# Altium schematic sheet IO Peripherals.SchDoc
size A4; DocumentNumber: 6; Revision: C.01; SheetNumber: 6; SheetTotal: 7
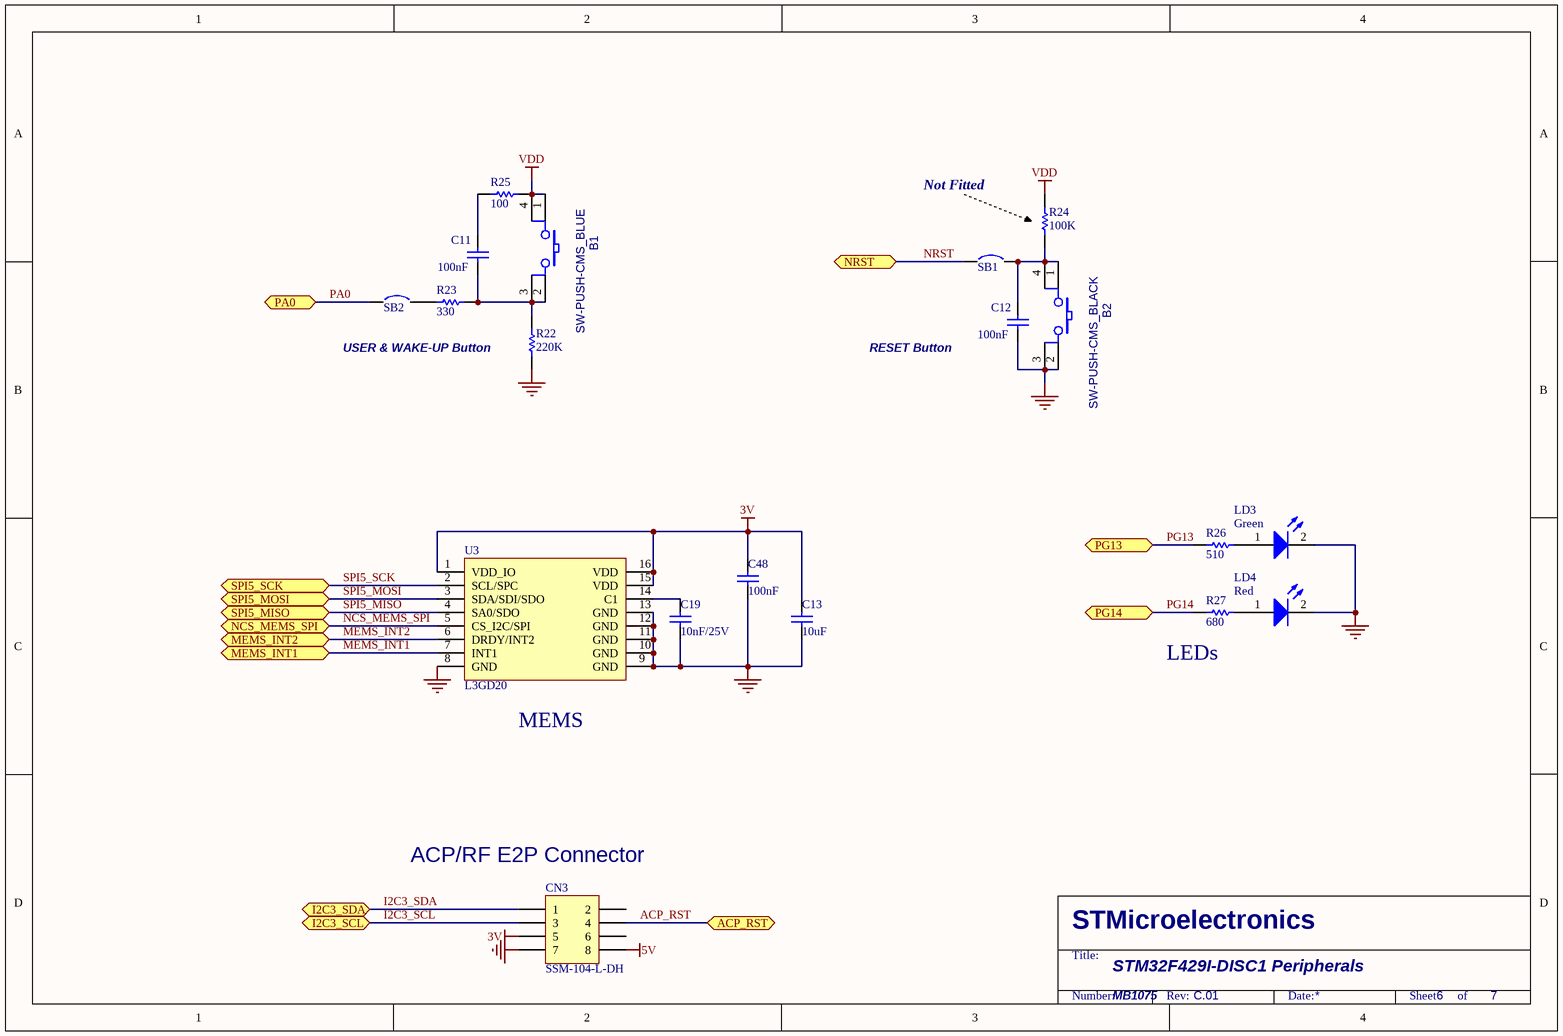
[diagram p0: IO Peripherals.SchDoc]

## Parts
B1  SW-PUSH-CMS_BLUE  [BP1CMS]
B2  SW-PUSH-CMS_BLACK  [BP1CMS]
C11  100nF  [0402C]
C12  100nF  [0402C]
C13  10uF  [0603C]
C19  10nF/25V  [0603C]
C48  100nF  [0402C]
CN3  SSM-104-L-DH  [SSM-104-L-DH]
LD3  Green  [0603D]
LD4  Red  [0603D]
R22  220K  [0402R]
R23  330  [0402R]
R24  100K  [0402R]
R25  100  [0402R]
R26  510  [0603R]
R27  680  [0603R]
SB1  Circuit Breaker  [JP2_SMD]  (value not drawn)
SB2  Circuit Breaker  [JP2_SMD]  (value not drawn)
U3  L3GD20  [LGA16-4x4]

## Ports
ACP_RST, I2C3_SCL, I2C3_SDA, MEMS_INT1, MEMS_INT2, NCS_MEMS_SPI, NRST, PA0, PG13, PG14, SPI5_MISO, SPI5_MOSI, SPI5_SCK

## Nets
3V: C13.2 C48.2 CN3.5 U3.1(VDD_IO) U3.15(VDD) U3.16(VDD)
5V: CN3.8
GND: B2.2 B2.3 C12.1 C13.1 C19.1 C48.1 CN3.7 LD3.2(K) LD4.2(K) R22.1 U3.8(GND) U3.9(GND) U3.10(GND) U3.11(GND) U3.12(GND) U3.13(GND)
VDD: B1.1 B1.4 R24.2 R25.2
ACP_RST: CN3.4 ; port ACP_RST
I2C3_SCL: CN3.3 ; port I2C3_SCL
I2C3_SDA: CN3.1 ; port I2C3_SDA
MEMS_INT1: U3.7(INT1) ; port MEMS_INT1
MEMS_INT2: U3.6(DRDY/INT2) ; port MEMS_INT2
NCS_MEMS_SPI: U3.5(CS_I2C/SPI) ; port NCS_MEMS_SPI
NRST: SB1.1 ; port NRST
PA0: SB2.1 ; port PA0
PG13: R26.1 ; port PG13
PG14: R27.1 ; port PG14
SPI5_MISO: U3.4(SA0/SDO) ; port SPI5_MISO
SPI5_MOSI: U3.3(SDA/SDI/SDO) ; port SPI5_MOSI
SPI5_SCK: U3.2(SCL/SPC) ; port SPI5_SCK
NetB1_2: B1.2 B1.3 C11.1 R22.2 R23.2
NetB2_1: B2.1 B2.4 C12.2 R24.1 SB1.2
NetC11_2: C11.2 R25.1
NetC19_2: C19.2 U3.14(C1)
NetLD3_1: LD3.1(A) R26.2
NetLD4_1: LD4.1(A) R27.2
NetR23_1: R23.1 SB2.2

Not connected (* = marked no-connect by the designer): CN3 2 6

## Notes on the sheet
- Not Fitted
- USER & WAKE-UP Button
- RESET Button
- (near R27) LEDs
- (near U3) MEMS
- (near CN3) ACP/RF E2P Connector
- STM32F429I-DISC1 Peripherals
- MB1075
- STMicroelectronics
- Title:
- Number:
- Rev:
- Date:
- Sheet       of

## Library data of the parts
B1 = SW-PUSH-CMS_BLUE: Non-Open Push-Button 0.1A 24V; Manuf_2: FARNELL; Manuf_Part_2: 535-930; Manuf_1: wealthmetal; Manuf_Part_1: TD0341X-G01-BLU; Ref St: 9180120; Description: Non-Open Push Button,Blue 0.1A 24V,Square head,6*6,SMT,180Degree,TD-0341X-GO1,wealthmetal; Distrib: *
B2 = SW-PUSH-CMS_BLACK: Non-Open Push-Button 0.1A 24V; Manuf_2: FARNELL; Manuf_Part_2: 535-930; Manuf_1: wealthmetal; Manuf_Part_1: TD0341X-G01-BLA; Ref St: 9180120; Description: Non-Open Push Button,Black 0.1A 24V,Square head,6*6,SMT,180Degree,TD-0341X-GO1,wealthmetal; Distrib: *
C11 C12 C48 = Capacitor_ST: Capacitor 0402 / 0603 / 0805; Revision: July-2002: Re-released for DXP Platform.; Value: 100nF
C13 C19 = CAP: Capacitor; Value: 100nF; Published: 8-Jun-2000; Revision: July-2002: Re-released for DXP Platform.; Publisher: Altium Limited
CN3 = SSM-104-L-DH: Header, 5-Pin, Dual row; Revision: 17-Jul-2002: Re-released for DXP Platform.; Publisher: Altium Limited
LD3 LD4 = LED2: Typical RED, GREEN, YELLOW, AMBER GaAs LED; Published: 8-Jun-2000; Revision: July-2002: Re-released for DXP Platform.; Publisher: Altium Limited
R22-R27 = Resistor_ST: Resistor 0402 / 0603 / 0805; Description: Resistor 0402 or 0603 or 0805; Value: 10K
SB1 SB2 = Circuit Breaker: Solder: YES; Published: 24-Mar-1999; Revision: July-2002: Re-released for DXP Platform.; Publisher: Altium Limited
U3 = L3GD20: MEMS motion sensor three-axis digital output gyroscopeelerometer; Manuf_1: STM; Manuf_Part_1: L3GD20TR; Provided: ST; Ref St: 9177042; ECCN_US/EU: EAR99/NEC; Distrib: ST; Footprint: LGA16(4*4); Order: L3GD20TR